# Altium schematic sheet ARCHITECTURE.SchDoc: Architecture
size 420 x 297 mm; SheetNumber: 1
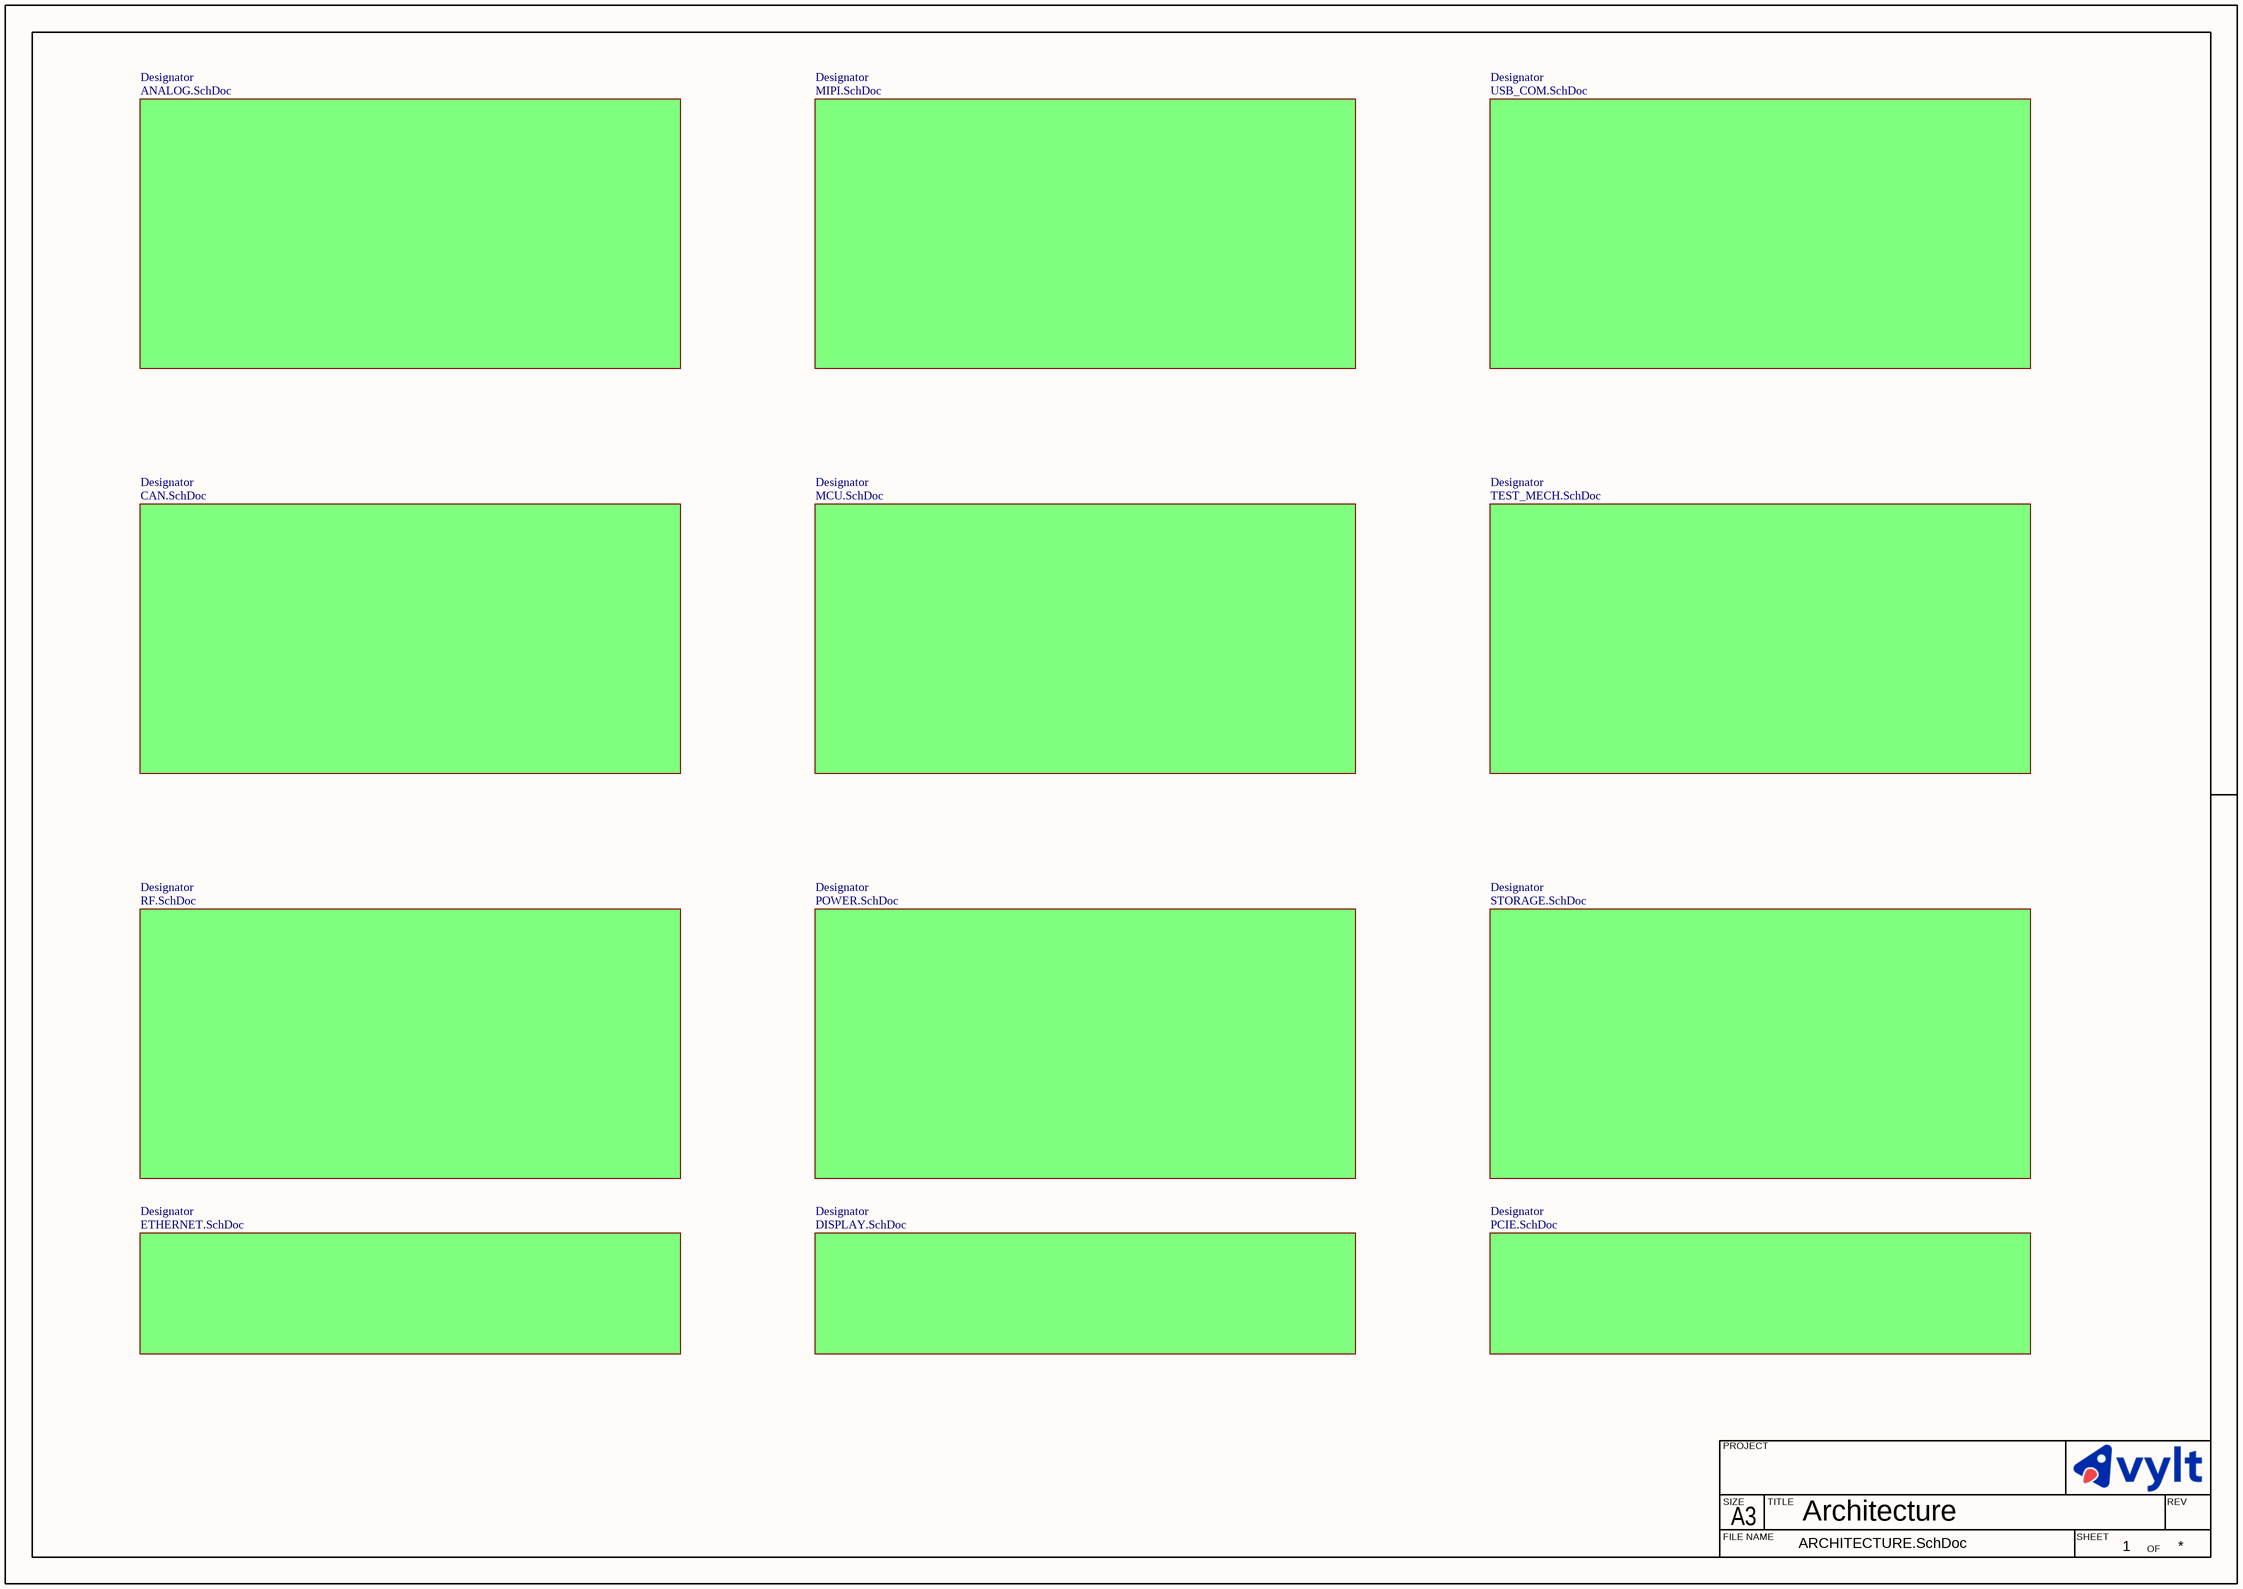
[diagram p0: ARCHITECTURE.SchDoc]

## Sub-sheets
Designator = MCU.SchDoc: no entries
Designator = USB_COM.SchDoc: no entries
Designator = TEST_MECH.SchDoc: no entries
Designator = STORAGE.SchDoc: no entries
Designator = ANALOG.SchDoc: no entries
Designator = CAN.SchDoc: no entries
Designator = RF.SchDoc: no entries
Designator = POWER.SchDoc: no entries
Designator = MIPI.SchDoc: no entries
Designator = ETHERNET.SchDoc: no entries
Designator = DISPLAY.SchDoc: no entries
Designator = PCIE.SchDoc: no entries

## Notes on the sheet
- PROJECT
- SIZE
- FILE NAME
- A3
- TITLE
- SHEET
- OF
- REV